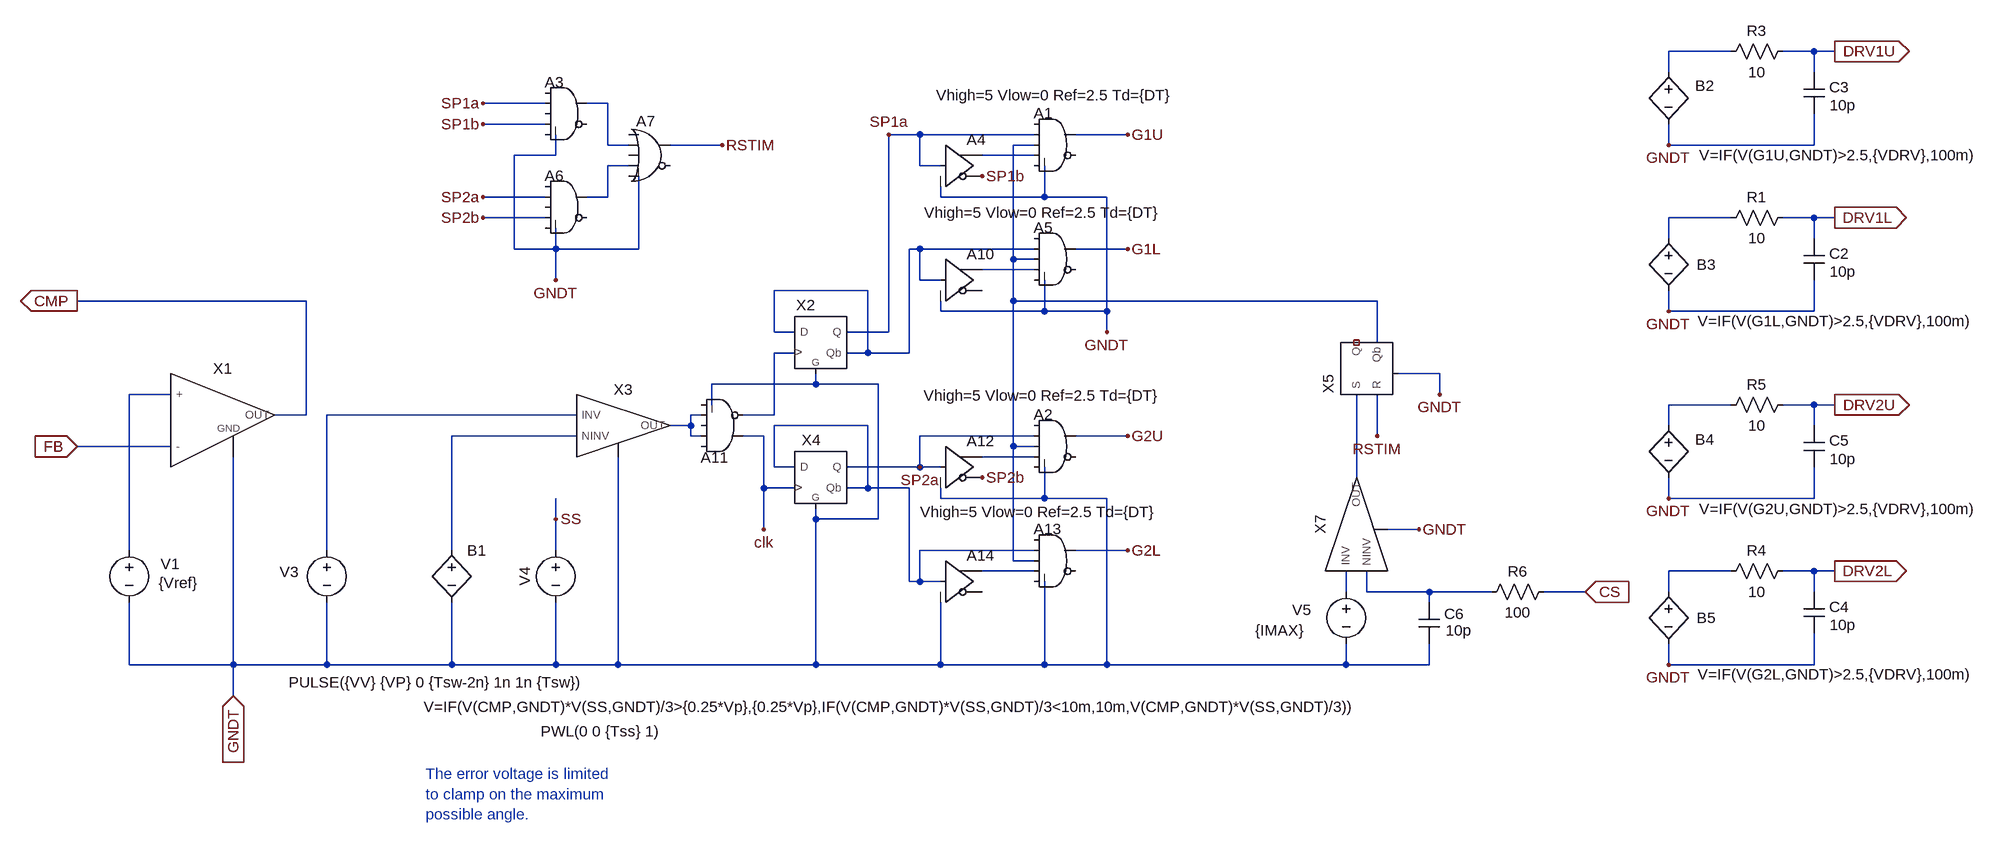
[diagram p0: schematic Generic_DAB_VM_PWM.asc]
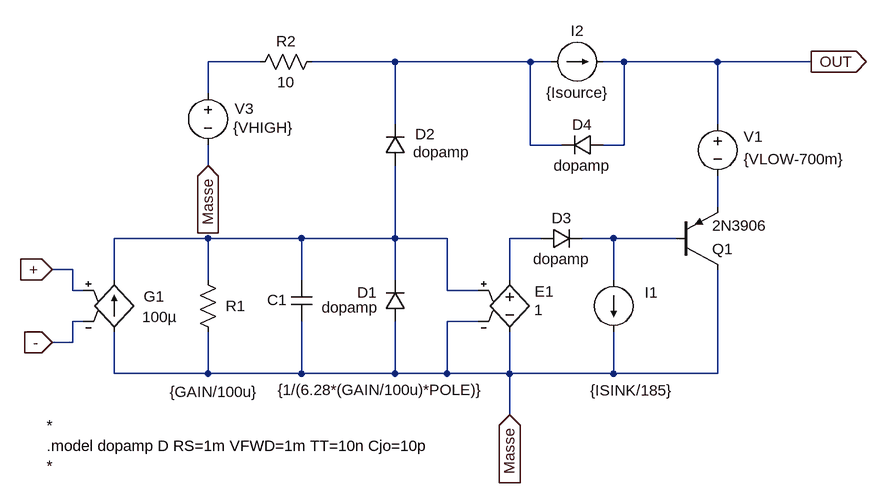
[diagram p1: sub-circuit op_amp_fan_out.asc]
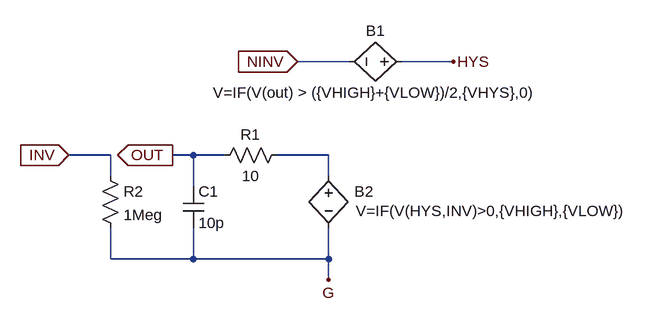
[diagram p2: sub-circuit comptof_g.asc]
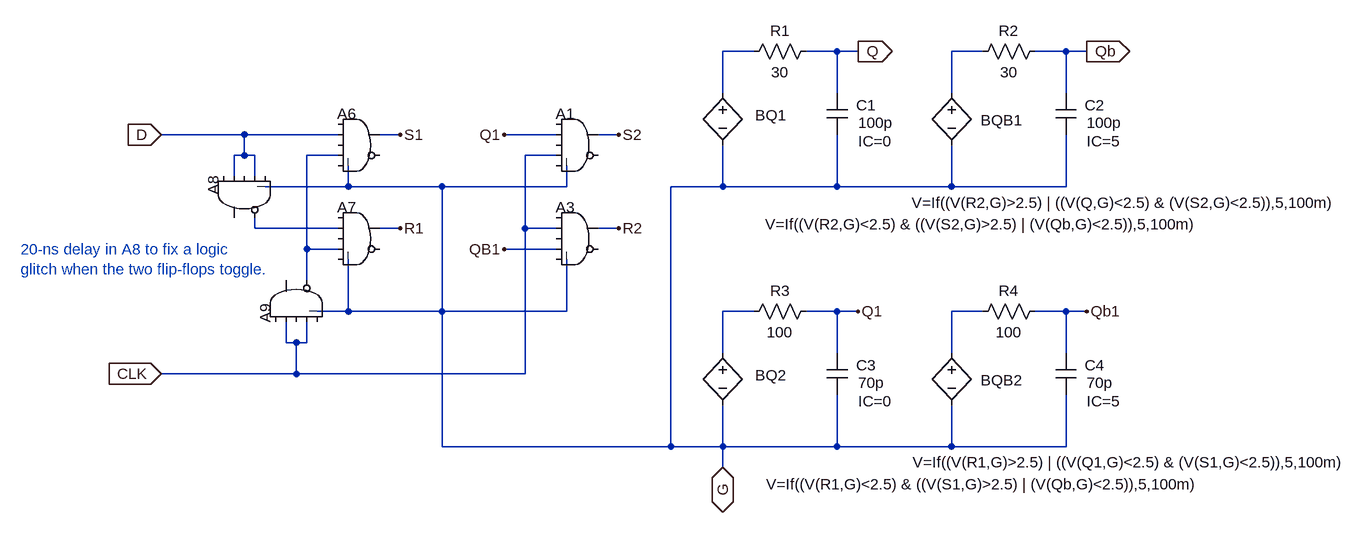
[diagram p3: sub-circuit d_flipflop_g.asc]
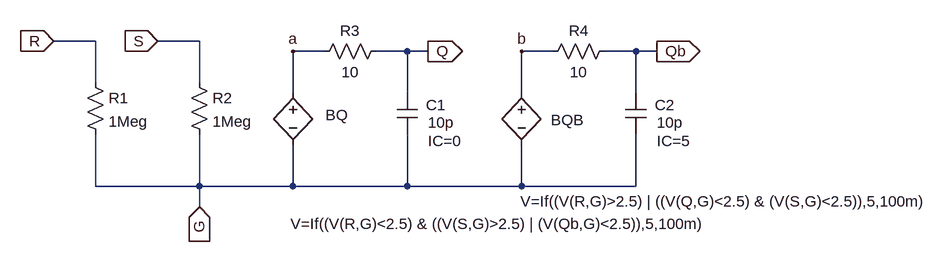
[diagram p4: sub-circuit sr_latch_g.asc]
Generic_DAB_VM_PWM.asc, the LTspice schematic file:
Version 4.1
SHEET 1 1568 1692
WIRE 1072 -832 976 -832
WIRE 1200 -832 1152 -832
WIRE 1232 -832 1200 -832
WIRE 976 -800 976 -832
WIRE 1200 -800 1200 -832
WIRE -752 -752 -848 -752
WIRE -656 -752 -688 -752
WIRE -752 -720 -848 -720
WIRE -176 -704 -224 -704
WIRE 0 -704 -176 -704
WIRE 144 -704 64 -704
WIRE -656 -688 -656 -752
WIRE -624 -688 -656 -688
WIRE -480 -688 -560 -688
WIRE 0 -688 -32 -688
WIRE 976 -688 976 -720
WIRE 1200 -688 1200 -736
WIRE 1200 -688 976 -688
WIRE -736 -672 -736 -704
WIRE -736 -672 -800 -672
WIRE 0 -672 -80 -672
WIRE -624 -656 -656 -656
WIRE -176 -656 -176 -704
WIRE -144 -656 -176 -656
WIRE -752 -608 -848 -608
WIRE -656 -608 -656 -656
WIRE -656 -608 -688 -608
WIRE -144 -608 -144 -624
WIRE 16 -608 16 -656
WIRE 16 -608 -144 -608
WIRE 112 -608 16 -608
WIRE -752 -576 -848 -576
WIRE 1072 -576 976 -576
WIRE 1200 -576 1152 -576
WIRE 1232 -576 1200 -576
WIRE 976 -544 976 -576
WIRE 1200 -544 1200 -576
WIRE -800 -528 -800 -672
WIRE -736 -528 -736 -560
WIRE -736 -528 -800 -528
WIRE -608 -528 -608 -640
WIRE -608 -528 -736 -528
WIRE -176 -528 -192 -528
WIRE 0 -528 -176 -528
WIRE 144 -528 64 -528
WIRE -32 -512 -32 -688
WIRE 0 -512 -32 -512
WIRE 0 -496 -80 -496
WIRE -736 -480 -736 -528
WIRE -176 -480 -176 -528
WIRE -144 -480 -176 -480
WIRE -256 -464 -400 -464
WIRE -1120 -448 -1472 -448
WIRE -32 -448 -32 -512
WIRE 528 -448 -32 -448
WIRE -144 -432 -144 -448
WIRE 16 -432 16 -480
WIRE 16 -432 -144 -432
WIRE 112 -432 112 -608
WIRE 112 -432 16 -432
WIRE 976 -432 976 -464
WIRE 1200 -432 1200 -480
WIRE 1200 -432 976 -432
WIRE -400 -400 -400 -464
WIRE -368 -400 -400 -400
WIRE -224 -400 -224 -704
WIRE -224 -400 -288 -400
WIRE 112 -400 112 -432
WIRE 528 -384 528 -448
WIRE -368 -368 -400 -368
WIRE -256 -368 -256 -464
WIRE -256 -368 -288 -368
WIRE -192 -368 -192 -528
WIRE -192 -368 -256 -368
WIRE 624 -336 560 -336
WIRE -336 -320 -336 -336
WIRE -336 -320 -496 -320
WIRE -240 -320 -336 -320
WIRE -1328 -304 -1392 -304
WIRE 624 -304 624 -336
WIRE -496 -288 -496 -320
WIRE 1072 -288 976 -288
WIRE 1200 -288 1152 -288
WIRE 1232 -288 1200 -288
WIRE -1120 -272 -1120 -448
WIRE -1120 -272 -1168 -272
WIRE -704 -272 -1088 -272
WIRE -512 -272 -528 -272
WIRE -400 -272 -400 -368
WIRE -400 -272 -448 -272
WIRE -528 -256 -528 -272
WIRE -528 -256 -560 -256
WIRE -256 -256 -400 -256
WIRE 976 -256 976 -288
WIRE 1200 -256 1200 -288
WIRE -704 -240 -896 -240
WIRE -528 -240 -528 -256
WIRE -512 -240 -528 -240
WIRE -416 -240 -448 -240
WIRE 0 -240 -176 -240
WIRE 144 -240 64 -240
WIRE 528 -240 528 -304
WIRE -1328 -224 -1472 -224
WIRE -32 -224 -32 -448
WIRE 0 -224 -32 -224
WIRE 0 -208 -80 -208
WIRE -400 -192 -400 -256
WIRE -368 -192 -400 -192
WIRE -176 -192 -176 -240
WIRE -176 -192 -288 -192
WIRE -144 -192 -176 -192
WIRE 496 -176 496 -304
WIRE -416 -160 -416 -240
WIRE -368 -160 -416 -160
WIRE -256 -160 -256 -256
WIRE -256 -160 -288 -160
WIRE -192 -160 -256 -160
WIRE -144 -144 -144 -160
WIRE 16 -144 16 -192
WIRE 16 -144 -144 -144
WIRE 112 -144 16 -144
WIRE 976 -144 976 -176
WIRE 1200 -144 1200 -192
WIRE 1200 -144 976 -144
WIRE -736 -112 -736 -144
WIRE -336 -112 -336 -128
WIRE -240 -112 -240 -320
WIRE -240 -112 -336 -112
WIRE -416 -96 -416 -160
WIRE 592 -96 544 -96
WIRE -1392 -64 -1392 -304
WIRE -1088 -64 -1088 -272
WIRE -896 -64 -896 -240
WIRE -736 -64 -736 -112
WIRE 0 -64 -176 -64
WIRE 144 -64 64 -64
WIRE -32 -48 -32 -224
WIRE 0 -48 -32 -48
WIRE 0 -32 -80 -32
WIRE 1072 -32 976 -32
WIRE 1200 -32 1152 -32
WIRE 1232 -32 1200 -32
WIRE -192 -16 -192 -160
WIRE -176 -16 -176 -64
WIRE -176 -16 -192 -16
WIRE -144 -16 -176 -16
WIRE 480 0 480 -32
WIRE 512 0 512 -32
WIRE 608 0 512 0
WIRE 704 0 608 0
WIRE 848 0 784 0
WIRE 976 0 976 -32
WIRE 1200 0 1200 -32
WIRE 608 16 608 0
WIRE -1392 112 -1392 16
WIRE -1232 112 -1232 -208
WIRE -1232 112 -1392 112
WIRE -1088 112 -1088 16
WIRE -1088 112 -1232 112
WIRE -896 112 -896 16
WIRE -896 112 -1088 112
WIRE -736 112 -736 16
WIRE -736 112 -896 112
WIRE -640 112 -640 -208
WIRE -640 112 -736 112
WIRE -336 112 -336 -112
WIRE -336 112 -640 112
WIRE -144 112 -144 16
WIRE -144 112 -336 112
WIRE 16 112 16 -16
WIRE 16 112 -144 112
WIRE 112 112 112 -144
WIRE 112 112 16 112
WIRE 480 112 480 80
WIRE 480 112 112 112
WIRE 608 112 608 80
WIRE 608 112 480 112
WIRE 976 112 976 80
WIRE 1200 112 1200 64
WIRE 1200 112 976 112
WIRE -1232 160 -1232 112
FLAG -1472 -448 CMP
IOPIN -1472 -448 Out
FLAG -1472 -224 FB
IOPIN -1472 -224 In
FLAG -1232 160 GNDT
IOPIN -1232 160 In
FLAG -736 -112 SS
FLAG 976 -432 GNDT
FLAG 976 -688 GNDT
FLAG 1232 -576 DRV1L
IOPIN 1232 -576 Out
FLAG 1232 -832 DRV1U
IOPIN 1232 -832 Out
FLAG 976 112 GNDT
FLAG 976 -144 GNDT
FLAG 1232 -32 DRV2L
IOPIN 1232 -32 Out
FLAG 1232 -288 DRV2U
IOPIN 1232 -288 Out
FLAG 144 -704 G1U
FLAG 144 -528 G1L
FLAG 144 -240 G2U
FLAG 144 -64 G2L
FLAG 112 -400 GNDT
FLAG -416 -96 clk
FLAG -224 -704 SP1a
FLAG -80 -640 SP1b
FLAG -176 -192 SP2a
FLAG -80 -176 SP2b
FLAG 848 0 CS
IOPIN 848 0 In
FLAG 592 -96 GNDT
FLAG 624 -304 GNDT
FLAG 528 -240 RSTIM
FLAG -848 -752 SP1a
FLAG -848 -720 SP1b
FLAG -848 -608 SP2a
FLAG -848 -576 SP2b
FLAG -480 -688 RSTIM
FLAG -736 -480 GNDT
SYMBOL op_amp_fan_out -1248 -272 R0
SYMATTR InstName X1
SYMATTR SpiceLine gain={gain} pole={pole} Isink={Isink} Isource={Isource} Vlow={VOL} Vhigh={VOH}
SYMBOL voltage -1392 -80 R0
WINDOW 0 48 37 Left 2
WINDOW 3 45 66 Left 2
SYMATTR InstName V1
SYMATTR Value {Vref}
SYMBOL voltage -1088 -80 R0
WINDOW 0 -73 49 Left 2
WINDOW 3 -59 219 Left 2
WINDOW 123 0 0 Left 0
WINDOW 39 0 0 Left 0
SYMATTR InstName V3
SYMATTR Value PULSE({VV} {VP} 0 {Tsw-2n} 1n 1n {Tsw})
SYMBOL bv -896 -80 R0
WINDOW 3 -43 257 Left 2
SYMATTR Value V=IF(V(CMP,GNDT)*V(SS,GNDT)/3>{0.25*Vp},{0.25*Vp},IF(V(CMP,GNDT)*V(SS,GNDT)/3<10m,10m,V(CMP,GNDT)*V(SS,GNDT)/3))
SYMATTR InstName B1
SYMBOL voltage -736 -80 R0
WINDOW 0 -32 56 VBottom 2
WINDOW 3 69 279 Top 2
WINDOW 123 0 0 Left 0
WINDOW 39 0 0 Left 0
SYMATTR InstName V4
SYMATTR Value PWL(0 0 {Tss} 1)
SYMBOL bv 976 -816 R0
WINDOW 0 41 37 Left 2
WINDOW 3 47 144 Left 2
SYMATTR InstName B2
SYMATTR Value V=IF(V(G1U,GNDT)>2.5,{VDRV},100m)
SYMBOL bv 976 -560 R0
WINDOW 0 43 56 Left 2
WINDOW 3 45 143 Left 2
SYMATTR InstName B3
SYMATTR Value V=IF(V(G1L,GNDT)>2.5,{VDRV},100m)
SYMBOL res 1168 -592 R90
WINDOW 0 0 56 VBottom 2
WINDOW 3 32 56 VTop 2
SYMATTR InstName R1
SYMATTR Value 10
SYMBOL cap 1184 -544 R0
WINDOW 0 39 23 Left 2
WINDOW 3 40 51 Left 2
SYMATTR InstName C2
SYMATTR Value 10p
SYMBOL res 1168 -848 R90
WINDOW 0 0 56 VBottom 2
WINDOW 3 32 56 VTop 2
SYMATTR InstName R3
SYMATTR Value 10
SYMBOL cap 1184 -800 R0
WINDOW 0 39 23 Left 2
WINDOW 3 40 51 Left 2
SYMATTR InstName C3
SYMATTR Value 10p
SYMBOL Digital\\and 32 -752 R0
WINDOW 0 -33 15 Left 2
SYMATTR InstName A1
SYMATTR SpiceLine Vhigh=5 Vlow=0 Ref=2.5
SYMBOL Digital\\buf -144 -720 R0
WINDOW 39 -7 -45 Left 2
SYMATTR SpiceLine Vhigh=5 Vlow=0 Ref=2.5 Td={DT}
SYMATTR InstName A4
SYMBOL Digital\\and 32 -576 R0
WINDOW 0 -33 15 Left 2
SYMATTR InstName A5
SYMATTR SpiceLine Vhigh=5 Vlow=0 Ref=2.5
SYMBOL Digital\\buf -144 -544 R0
WINDOW 39 -25 -40 Left 2
SYMATTR SpiceLine Vhigh=5 Vlow=0 Ref=2.5 Td={DT}
SYMATTR InstName A10
SYMBOL Digital\\and -480 -192 M180
WINDOW 0 -33 15 Left 2
SYMATTR InstName A11
SYMATTR SpiceLine Vhigh=5 Vlow=0 Ref=2.5
SYMBOL Digital\\and 32 -288 R0
WINDOW 0 -33 15 Left 2
SYMATTR InstName A2
SYMATTR SpiceLine Vhigh=5 Vlow=0 Ref=2.5
SYMBOL Digital\\buf -144 -256 R0
WINDOW 39 -26 -46 Left 2
SYMATTR SpiceLine Vhigh=5 Vlow=0 Ref=2.5 Td={DT}
SYMATTR InstName A12
SYMBOL Digital\\and 32 -112 R0
WINDOW 0 -33 15 Left 2
SYMATTR InstName A13
SYMATTR SpiceLine Vhigh=5 Vlow=0 Ref=2.5
SYMBOL Digital\\buf -144 -80 R0
WINDOW 39 -31 -43 Left 2
SYMATTR SpiceLine Vhigh=5 Vlow=0 Ref=2.5 Td={DT}
SYMATTR InstName A14
SYMBOL bv 976 -272 R0
WINDOW 0 41 37 Left 2
WINDOW 3 47 144 Left 2
SYMATTR InstName B4
SYMATTR Value V=IF(V(G2U,GNDT)>2.5,{VDRV},100m)
SYMBOL bv 976 -16 R0
WINDOW 0 43 56 Left 2
WINDOW 3 45 143 Left 2
SYMATTR InstName B5
SYMATTR Value V=IF(V(G2L,GNDT)>2.5,{VDRV},100m)
SYMBOL res 1168 -48 R90
WINDOW 0 0 56 VBottom 2
WINDOW 3 32 56 VTop 2
SYMATTR InstName R4
SYMATTR Value 10
SYMBOL cap 1184 0 R0
WINDOW 0 39 23 Left 2
WINDOW 3 40 51 Left 2
SYMATTR InstName C4
SYMATTR Value 10p
SYMBOL res 1168 -304 R90
WINDOW 0 0 56 VBottom 2
WINDOW 3 32 56 VTop 2
SYMATTR InstName R5
SYMATTR Value 10
SYMBOL cap 1184 -256 R0
WINDOW 0 39 23 Left 2
WINDOW 3 40 51 Left 2
SYMATTR InstName C5
SYMATTR Value 10p
SYMBOL voltage 480 -16 R0
WINDOW 0 -83 44 Left 2
WINDOW 3 -140 75 Left 2
SYMATTR InstName V5
SYMATTR Value {IMAX}
SYMBOL res 800 -16 R90
WINDOW 0 0 56 VBottom 2
WINDOW 3 32 56 VTop 2
SYMATTR InstName R6
SYMATTR Value 100
SYMBOL cap 592 16 R0
WINDOW 0 39 18 Left 2
WINDOW 3 41 43 Left 2
SYMATTR InstName C6
SYMATTR Value 10p
SYMBOL Digital\\and -720 -800 R0
WINDOW 0 -33 15 Left 2
SYMATTR InstName A3
SYMATTR SpiceLine Vhigh=5 Vlow=0 Ref=2.5
SYMBOL Digital\\and -720 -656 R0
WINDOW 0 -33 15 Left 2
SYMATTR InstName A6
SYMATTR SpiceLine Vhigh=5 Vlow=0 Ref=2.5
SYMBOL Digital\\or -592 -736 R0
WINDOW 0 -20 11 Left 2
SYMATTR InstName A7
SYMATTR SpiceLine Vhigh=5 Vlow=0 Ref=2.5
SYMBOL TOF\\Subcircuits\\COMPTOF_G -640 -256 R0
SYMATTR InstName X3
SYMATTR SpiceLine VHIGH=5 VLOW=100m VHYS=10m
SYMBOL TOF\\Subcircuits\\D_FlipFlop_G -336 -384 R0
WINDOW 0 -15 -42 Bottom 2
SYMATTR InstName X2
SYMBOL TOF\\Subcircuits\\D_FlipFlop_G -336 -176 R0
WINDOW 0 -7 -42 Bottom 2
SYMATTR InstName X4
SYMBOL TOF\\Subcircuits\\SR_latch_G 512 -336 R270
WINDOW 0 -16 -44 Bottom 2
SYMATTR InstName X5
SYMBOL TOF\\Subcircuits\\COMPTOF_G 496 -96 R270
SYMATTR InstName X7
SYMATTR SpiceLine VHIGH=5 VLOW=100m VHYS=50m
TEXT -936 280 Left 2 ;The error voltage is limited\nto clamp on the maximum \npossible angle.

op_amp_fan_out.asc, the sub-circuit schematic file:
Version 4.1
SHEET 1 1504 680
WIRE 96 -224 16 -224
WIRE 304 -224 176 -224
WIRE 512 -224 304 -224
WIRE 544 -224 512 -224
WIRE 656 -224 624 -224
WIRE 800 -224 656 -224
WIRE 944 -224 800 -224
WIRE 16 -176 16 -224
WIRE 304 -128 304 -224
WIRE 800 -128 800 -224
WIRE 512 -96 512 -224
WIRE 560 -96 512 -96
WIRE 656 -96 656 -224
WIRE 656 -96 624 -96
WIRE 16 -64 16 -96
WIRE 800 0 800 -48
WIRE 16 48 -128 48
WIRE 160 48 16 48
WIRE 304 48 304 -64
WIRE 304 48 160 48
WIRE 384 48 304 48
WIRE 528 48 480 48
WIRE 640 48 592 48
WIRE 736 48 640 48
WIRE -192 96 -224 96
WIRE -128 112 -128 48
WIRE 16 112 16 48
WIRE 160 112 160 48
WIRE 304 112 304 48
WIRE 480 112 480 48
WIRE 640 112 640 48
WIRE -192 128 -192 96
WIRE -176 128 -192 128
WIRE 384 128 384 48
WIRE 432 128 384 128
WIRE -176 176 -192 176
WIRE 432 176 384 176
WIRE -192 208 -192 176
WIRE -192 208 -224 208
WIRE -128 256 -128 192
WIRE 16 256 16 192
WIRE 16 256 -128 256
WIRE 160 256 160 176
WIRE 160 256 16 256
WIRE 304 256 304 176
WIRE 304 256 160 256
WIRE 384 256 384 176
WIRE 384 256 304 256
WIRE 480 256 480 192
WIRE 480 256 384 256
WIRE 640 256 640 192
WIRE 640 256 480 256
WIRE 800 256 800 96
WIRE 800 256 640 256
WIRE 480 320 480 256
FLAG -224 96 +
IOPIN -224 96 In
FLAG -224 208 -
IOPIN -224 208 In
FLAG 944 -224 OUT
IOPIN 944 -224 Out
FLAG 480 320 Masse
IOPIN 480 320 In
FLAG 16 -64 Masse
IOPIN 16 -64 In
DATAFLAG 800 -16 ""
SYMBOL g -128 96 R0
WINDOW 0 45 41 Left 2
WINDOW 3 43 73 Left 2
SYMATTR InstName G1
SYMATTR Value 100µ
SYMBOL res 0 96 R0
WINDOW 0 43 56 Left 2
WINDOW 3 -43 188 Left 2
SYMATTR InstName R1
SYMATTR Value {GAIN/100u}
SYMBOL cap 144 112 R0
WINDOW 0 -37 31 Left 2
WINDOW 3 -21 169 Left 2
SYMATTR InstName C1
SYMATTR Value {1/(6.28*(GAIN/100u)*POLE)}
SYMBOL diode 320 176 R180
WINDOW 0 44 45 Left 2
WINDOW 3 41 22 Left 2
SYMATTR InstName D1
SYMATTR Value dopamp
SYMBOL e 480 96 R0
WINDOW 0 39 34 Left 2
WINDOW 3 38 62 Left 2
SYMATTR InstName E1
SYMATTR Value 1
SYMBOL diode 528 64 R270
WINDOW 0 32 32 VTop 2
WINDOW 3 0 32 VBottom 2
SYMATTR InstName D3
SYMATTR Value dopamp
SYMBOL current 640 112 R0
WINDOW 0 48 19 Left 2
WINDOW 3 -36 170 Left 2
SYMATTR InstName I1
SYMATTR Value {ISINK/185}
SYMBOL pnp 736 96 M180
SYMATTR InstName Q1
SYMATTR Value 2N3906
SYMBOL voltage 800 -144 R0
WINDOW 0 40 35 Left 2
WINDOW 3 40 70 Left 2
SYMATTR InstName V1
SYMATTR Value {VLOW-700m}
SYMBOL current 544 -224 R270
WINDOW 0 32 40 VTop 2
WINDOW 3 -32 40 VBottom 2
SYMATTR InstName I2
SYMATTR Value {Isource}
SYMBOL diode 624 -80 M270
WINDOW 0 32 32 VTop 2
WINDOW 3 0 32 VBottom 2
SYMATTR InstName D4
SYMATTR Value dopamp
SYMBOL voltage 16 -192 R0
WINDOW 0 41 40 Left 2
WINDOW 3 39 69 Left 2
SYMATTR InstName V3
SYMATTR Value {VHIGH}
SYMBOL diode 288 -64 M180
WINDOW 0 47 49 Left 2
WINDOW 3 44 21 Left 2
SYMATTR InstName D2
SYMATTR Value dopamp
SYMBOL res 192 -240 R90
WINDOW 0 0 56 VBottom 2
WINDOW 3 32 56 VTop 2
SYMATTR InstName R2
SYMATTR Value 10
TEXT -232 336 Left 2 !*\n.model dopamp D RS=1m VFWD=1m TT=10n Cjo=10p\n*

comptof_g.asc, the sub-circuit schematic file:
Version 4.1
SHEET 1 880 680
WIRE 64 192 -16 192
WIRE 224 192 144 192
WIRE -304 336 -368 336
WIRE -176 336 -208 336
WIRE -128 336 -176 336
WIRE 32 336 -48 336
WIRE -304 368 -304 336
WIRE 32 368 32 336
WIRE -176 384 -176 336
WIRE -304 496 -304 448
WIRE -176 496 -176 448
WIRE -176 496 -304 496
WIRE 32 496 32 448
WIRE 32 496 -176 496
WIRE 32 528 32 496
FLAG -16 192 NINV
IOPIN -16 192 In
FLAG 224 192 HYS
FLAG -208 336 OUT
IOPIN -208 336 Out
FLAG -368 336 INV
IOPIN -368 336 In
FLAG 32 528 G
SYMBOL bv 160 192 R90
WINDOW 0 -32 56 VBottom 2
WINDOW 3 32 56 VTop 2
SYMATTR InstName B1
SYMATTR Value V=IF(V(out) > ({VHIGH}+{VLOW})/2,{VHYS},0)
SYMBOL bv 32 352 R0
WINDOW 0 40 40 Left 2
WINDOW 3 42 70 Left 2
SYMATTR InstName B2
SYMATTR Value V=IF(V(HYS,INV)>0,{VHIGH},{VLOW})
SYMBOL res -32 320 R90
WINDOW 0 0 56 VBottom 2
WINDOW 3 32 56 VTop 2
SYMATTR InstName R1
SYMATTR Value 10
SYMBOL cap -192 384 R0
SYMATTR InstName C1
SYMATTR Value 10p
SYMBOL res -320 352 R0
SYMATTR InstName R2
SYMATTR Value 1Meg

d_flipflop_g.asc, the sub-circuit schematic file:
Version 4.1
SHEET 1 1820 1368
WIRE 768 448 720 448
WIRE 896 448 848 448
WIRE 928 448 896 448
WIRE 1120 448 1072 448
WIRE 1248 448 1200 448
WIRE 1280 448 1248 448
WIRE 720 512 720 448
WIRE 896 512 896 448
WIRE 1072 512 1072 448
WIRE 1248 512 1248 448
WIRE -16 576 -144 576
WIRE 128 576 -16 576
WIRE 224 576 192 576
WIRE 464 576 384 576
WIRE 560 576 528 576
WIRE -16 608 -16 576
WIRE -16 608 -32 608
WIRE 0 608 -16 608
WIRE 128 608 80 608
WIRE 464 608 416 608
WIRE -32 640 -32 608
WIRE 0 640 0 608
WIRE 144 656 144 624
WIRE 144 656 16 656
WIRE 288 656 144 656
WIRE 480 656 480 624
WIRE 480 656 288 656
WIRE 720 656 720 592
WIRE 720 656 640 656
WIRE 896 656 896 576
WIRE 896 656 720 656
WIRE 1072 656 1072 592
WIRE 1072 656 896 656
WIRE 1248 656 1248 576
WIRE 1248 656 1072 656
WIRE 0 720 0 704
WIRE 128 720 0 720
WIRE 224 720 192 720
WIRE 416 720 416 608
WIRE 464 720 416 720
WIRE 560 720 528 720
WIRE 80 752 80 608
WIRE 128 752 80 752
WIRE 464 752 384 752
WIRE 80 800 80 752
WIRE 144 848 144 768
WIRE 144 848 96 848
WIRE 288 848 288 656
WIRE 288 848 144 848
WIRE 480 848 480 768
WIRE 480 848 288 848
WIRE 768 848 720 848
WIRE 896 848 848 848
WIRE 928 848 896 848
WIRE 1120 848 1072 848
WIRE 1248 848 1200 848
WIRE 1280 848 1248 848
WIRE 48 896 48 864
WIRE 64 896 48 896
WIRE 80 896 80 864
WIRE 80 896 64 896
WIRE 720 912 720 848
WIRE 896 912 896 848
WIRE 1072 912 1072 848
WIRE 1248 912 1248 848
WIRE 64 944 64 896
WIRE 64 944 -144 944
WIRE 416 944 416 720
WIRE 416 944 64 944
WIRE 288 1056 288 848
WIRE 640 1056 640 656
WIRE 640 1056 288 1056
WIRE 720 1056 720 992
WIRE 720 1056 640 1056
WIRE 896 1056 896 976
WIRE 896 1056 720 1056
WIRE 1072 1056 1072 992
WIRE 1072 1056 896 1056
WIRE 1248 1056 1248 976
WIRE 1248 1056 1072 1056
WIRE 720 1088 720 1056
FLAG -144 576 D
IOPIN -144 576 In
FLAG -144 944 CLK
IOPIN -144 944 In
FLAG 560 576 S2
FLAG 560 720 R2
FLAG 928 448 Q
IOPIN 928 448 Out
FLAG 1280 448 Qb
IOPIN 1280 448 Out
FLAG 224 576 S1
FLAG 224 720 R1
FLAG 384 576 Q1
FLAG 384 752 QB1
FLAG 928 848 Q1
FLAG 1280 848 Qb1
FLAG 720 1088 G
IOPIN 720 1088 BiDir
SYMBOL Digital\\and 496 528 R0
WINDOW 0 -33 16 Left 2
SYMATTR InstName A1
SYMATTR SpiceLine Vhigh=5 Vlow=100m Ref=2.5
SYMBOL Digital\\and 496 672 R0
WINDOW 0 -33 16 Left 2
SYMATTR InstName A3
SYMATTR SpiceLine Vhigh=5 Vlow=100m Ref=2.5
SYMBOL Digital\\and 160 528 R0
WINDOW 0 -33 16 Left 2
SYMATTR InstName A6
SYMATTR SpiceLine Vhigh=5 Vlow=100m Ref=2.5
SYMBOL Digital\\and 160 672 R0
WINDOW 0 -33 16 Left 2
SYMATTR InstName A7
SYMATTR SpiceLine Vhigh=5 Vlow=100m Ref=2.5
SYMBOL Digital\\and -80 672 M90
WINDOW 0 -33 16 Left 2
SYMATTR InstName A8
SYMATTR SpiceLine Vhigh=5 Vlow=100m Ref=2.5 Td=20n
SYMBOL Digital\\and 0 832 R270
WINDOW 0 -33 16 Left 2
SYMATTR InstName A9
SYMATTR SpiceLine Vhigh=5 Vlow=100m Ref=2.5
SYMBOL bv 720 496 R0
WINDOW 0 50 50 Left 2
WINDOW 3 65 218 Left 2
SYMATTR InstName BQ1
SYMATTR Value V=If((V(R2,G)<2.5) & ((V(S2,G)>2.5) | (V(Qb,G)<2.5)),5,100m)
SYMBOL res 864 432 R90
WINDOW 0 0 56 VBottom 2
WINDOW 3 32 56 VTop 2
SYMATTR InstName R1
SYMATTR Value 30
SYMBOL cap 880 512 R0
WINDOW 0 45 19 Left 2
WINDOW 3 48 46 Left 2
WINDOW 123 48 74 Left 2
SYMATTR InstName C1
SYMATTR Value 100p
SYMATTR Value2 IC=0
SYMBOL bv 1072 496 R0
WINDOW 0 45 58 Left 2
WINDOW 3 -61 185 Left 2
SYMATTR InstName BQB1
SYMATTR Value V=If((V(R2,G)>2.5) | ((V(Q,G)<2.5) & (V(S2,G)<2.5)),5,100m)
SYMBOL res 1216 432 R90
WINDOW 0 0 56 VBottom 2
WINDOW 3 32 56 VTop 2
SYMATTR InstName R2
SYMATTR Value 30
SYMBOL cap 1232 512 R0
WINDOW 0 45 19 Left 2
WINDOW 3 48 46 Left 2
WINDOW 123 48 74 Left 2
SYMATTR InstName C2
SYMATTR Value 100p
SYMATTR Value2 IC=5
SYMBOL bv 720 896 R0
WINDOW 0 50 50 Left 2
WINDOW 3 67 218 Left 2
SYMATTR InstName BQ2
SYMATTR Value V=If((V(R1,G)<2.5) & ((V(S1,G)>2.5) | (V(Qb,G)<2.5)),5,100m)
SYMBOL res 864 832 R90
WINDOW 0 0 56 VBottom 2
WINDOW 3 32 56 VTop 2
SYMATTR InstName R3
SYMATTR Value 100
SYMBOL cap 880 912 R0
WINDOW 0 45 19 Left 2
WINDOW 3 48 46 Left 2
WINDOW 123 48 74 Left 2
SYMATTR InstName C3
SYMATTR Value 70p
SYMATTR Value2 IC=0
SYMBOL bv 1072 896 R0
WINDOW 0 45 58 Left 2
WINDOW 3 -60 184 Left 2
SYMATTR InstName BQB2
SYMATTR Value V=If((V(R1,G)>2.5) | ((V(Q1,G)<2.5) & (V(S1,G)<2.5)),5,100m)
SYMBOL res 1216 832 R90
WINDOW 0 0 56 VBottom 2
WINDOW 3 32 56 VTop 2
SYMATTR InstName R4
SYMATTR Value 100
SYMBOL cap 1232 912 R0
WINDOW 0 45 19 Left 2
WINDOW 3 48 46 Left 2
WINDOW 123 48 74 Left 2
SYMATTR InstName C4
SYMATTR Value 70p
SYMATTR Value2 IC=5
TEXT -360 752 Left 2 ;20-ns delay in A8 to fix a logic \nglitch when the two flip-flops toggle.

sr_latch_g.asc, the sub-circuit schematic file:
Version 4.1
SHEET 1 1168 680
WIRE -192 48 -256 48
WIRE -32 48 -96 48
WIRE 160 64 112 64
WIRE 288 64 240 64
WIRE 320 64 288 64
WIRE 512 64 464 64
WIRE 640 64 592 64
WIRE 672 64 640 64
WIRE -192 112 -192 48
WIRE -32 112 -32 48
WIRE 112 128 112 64
WIRE 288 128 288 64
WIRE 464 128 464 64
WIRE 640 128 640 64
WIRE -192 272 -192 192
WIRE -32 272 -32 192
WIRE -32 272 -192 272
WIRE 112 272 112 208
WIRE 112 272 -32 272
WIRE 288 272 288 192
WIRE 288 272 112 272
WIRE 464 272 464 208
WIRE 464 272 288 272
WIRE 640 272 640 192
WIRE 640 272 464 272
WIRE -32 304 -32 272
FLAG -256 48 R
IOPIN -256 48 In
FLAG -96 48 S
IOPIN -96 48 In
FLAG 320 64 Q
IOPIN 320 64 Out
FLAG 672 64 Qb
IOPIN 672 64 Out
FLAG 112 64 a
FLAG 464 64 b
FLAG -32 304 G
IOPIN -32 304 In
SYMBOL bv 112 112 R0
WINDOW 0 50 50 Left 2
WINDOW 3 -4 218 Left 2
SYMATTR InstName BQ
SYMATTR Value V=If((V(R,G)<2.5) & ((V(S,G)>2.5) | (V(Qb,G)<2.5)),5,100m)
SYMBOL res -208 96 R0
SYMATTR InstName R1
SYMATTR Value 1Meg
SYMBOL res -48 96 R0
SYMATTR InstName R2
SYMATTR Value 1Meg
SYMBOL res 256 48 R90
WINDOW 0 0 56 VBottom 2
WINDOW 3 32 56 VTop 2
SYMATTR InstName R3
SYMATTR Value 10
SYMBOL cap 272 128 R0
WINDOW 0 45 19 Left 2
WINDOW 3 48 46 Left 2
WINDOW 123 48 74 Left 2
SYMATTR InstName C1
SYMATTR Value 10p
SYMATTR Value2 IC=0
SYMBOL bv 464 112 R0
WINDOW 0 45 58 Left 2
WINDOW 3 -2 183 Left 2
SYMATTR InstName BQB
SYMATTR Value V=If((V(R,G)>2.5) | ((V(Q,G)<2.5) & (V(S,G)<2.5)),5,100m)
SYMBOL res 608 48 R90
WINDOW 0 0 56 VBottom 2
WINDOW 3 32 56 VTop 2
SYMATTR InstName R4
SYMATTR Value 10
SYMBOL cap 624 128 R0
WINDOW 0 45 19 Left 2
WINDOW 3 48 46 Left 2
WINDOW 123 48 74 Left 2
SYMATTR InstName C2
SYMATTR Value 10p
SYMATTR Value2 IC=5

The netlist it stands for:
* Generic_DAB_VM_PWM.asc
X§X1 N010 FB GNDT CMP op_amp_fan_out params: gain={gain} pole={pole} Isink={Isink} Isource={Isource} Vlow={VOL} Vhigh={VOH}
V1 N010 GNDT {Vref}
V3 N012 GNDT PULSE({VV} {VP} 0 {Tsw-2n} 1n 1n {Tsw})
B1 N015 GNDT V=IF(V(CMP,GNDT)*V(SS,GNDT)/3>{0.25*Vp},{0.25*Vp},IF(V(CMP,GNDT)*V(SS,GNDT)/3<10m,10m,V(CMP,GNDT)*V(SS,GNDT)/3))
V4 SS GNDT PWL(0 0 {Tss} 1)
B2 N001 GNDT V=IF(V(G1U,GNDT)>2.5,{VDRV},100m)
B3 N006 GNDT V=IF(V(G1L,GNDT)>2.5,{VDRV},100m)
R1 DRV1L N006 10
C2 DRV1L GNDT 10p
R3 DRV1U N001 10
C3 DRV1U GNDT 10p
A1 GNDT SP1a N003 N004 GNDT GNDT G1U GNDT AND Vhigh=5 Vlow=0 Ref=2.5
A4 SP1a GNDT GNDT GNDT GNDT SP1b N004 GNDT BUF Vhigh=5 Vlow=0 Ref=2.5 Td={DT}
A5 GNDT N007 N003 N008 GNDT GNDT G1L GNDT AND Vhigh=5 Vlow=0 Ref=2.5
A10 N007 GNDT GNDT GNDT GNDT GNDT N008 GNDT BUF Vhigh=5 Vlow=0 Ref=2.5 Td={DT}
A11 GNDT N013 GNDT N013 GNDT N009 clk GNDT AND Vhigh=5 Vlow=0 Ref=2.5
A2 GNDT SP2a N003 N016 GNDT GNDT G2U GNDT AND Vhigh=5 Vlow=0 Ref=2.5
A12 SP2a GNDT GNDT GNDT GNDT SP2b N016 GNDT BUF Vhigh=5 Vlow=0 Ref=2.5 Td={DT}
A13 GNDT N014 N003 N018 GNDT GNDT G2L GNDT AND Vhigh=5 Vlow=0 Ref=2.5
A14 N014 GNDT GNDT GNDT GNDT GNDT N018 GNDT BUF Vhigh=5 Vlow=0 Ref=2.5 Td={DT}
B4 N011 GNDT V=IF(V(G2U,GNDT)>2.5,{VDRV},100m)
B5 N019 GNDT V=IF(V(G2L,GNDT)>2.5,{VDRV},100m)
R4 DRV2L N019 10
C4 DRV2L GNDT 10p
R5 DRV2U N011 10
C5 DRV2U GNDT 10p
V5 N020 GNDT {IMAX}
R6 CS N021 100
C6 N021 GNDT 10p
A3 GNDT SP1a GNDT SP1b GNDT GNDT N002 GNDT AND Vhigh=5 Vlow=0 Ref=2.5
A6 GNDT SP2a GNDT SP2b GNDT GNDT N005 GNDT AND Vhigh=5 Vlow=0 Ref=2.5
A7 GNDT N002 GNDT N005 GNDT GNDT RSTIM GNDT OR Vhigh=5 Vlow=0 Ref=2.5
X§X3 N012 N015 N013 GNDT comptof_g params: VHIGH=5 VLOW=100m VHYS=10m
X§X2 N007 N009 SP1a N007 GNDT d_flipflop_g
X§X4 N014 clk SP2a N014 GNDT d_flipflop_g
X§X5 RSTIM N017 NC_01 N003 GNDT sr_latch_g
X§X7 N020 N021 N017 GNDT comptof_g params: VHIGH=5 VLOW=100m VHYS=50m

* block symbol definitions
.subckt op_amp_fan_out + - Masse OUT
G1 Masse N004 + - 100µ
R1 N004 Masse {GAIN/100u}
C1 N004 Masse {1/(6.28*(GAIN/100u)*POLE)}
D1 Masse N004 dopamp
E1 N005 Masse N004 Masse 1
D3 N005 N006 dopamp
I1 N006 Masse {ISINK/185}
Q1 Masse N006 N003 0 2N3906
V1 OUT N003 {VLOW-700m}
I2 N002 OUT {Isource}
D4 OUT N002 dopamp
V3 N001 Masse {VHIGH}
D2 N004 N002 dopamp
R2 N002 N001 10
*
.model dopamp D RS=1m VFWD=1m TT=10n Cjo=10p
*
.ends op_amp_fan_out

.subckt comptof_g INV NINV OUT G
B1 HYS NINV V=IF(V(out) > ({VHIGH}+{VLOW})/2,{VHYS},0)
B2 N001 G V=IF(V(HYS,INV)>0,{VHIGH},{VLOW})
R1 N001 OUT 10
C1 OUT G 10p
R2 INV G 1Meg
.ends comptof_g

.subckt d_flipflop_g D CLK Q Qb G
A1 G Q1 G CLK G G S2 G AND Vhigh=5 Vlow=100m Ref=2.5
A3 G CLK G QB1 G G R2 G AND Vhigh=5 Vlow=100m Ref=2.5
A6 G D G N003 G G S1 G AND Vhigh=5 Vlow=100m Ref=2.5
A7 G N004 G N003 G G R1 G AND Vhigh=5 Vlow=100m Ref=2.5
A8 G D G D G N004 G G AND Vhigh=5 Vlow=100m Ref=2.5 Td=20n
A9 G CLK G CLK G N003 G G AND Vhigh=5 Vlow=100m Ref=2.5
BQ1 N001 G V=If((V(R2,G)<2.5) & ((V(S2,G)>2.5) | (V(Qb,G)<2.5)),5,100m)
R1 Q N001 30
C1 Q G 100p IC=0
BQB1 N002 G V=If((V(R2,G)>2.5) | ((V(Q,G)<2.5) & (V(S2,G)<2.5)),5,100m)
R2 Qb N002 30
C2 Qb G 100p IC=5
BQ2 N005 G V=If((V(R1,G)<2.5) & ((V(S1,G)>2.5) | (V(Qb,G)<2.5)),5,100m)
R3 Q1 N005 100
C3 Q1 G 70p IC=0
BQB2 N006 G V=If((V(R1,G)>2.5) | ((V(Q1,G)<2.5) & (V(S1,G)<2.5)),5,100m)
R4 QB1 N006 100
C4 QB1 G 70p IC=5
* 20-ns delay in A8 to fix a logic
* glitch when the two flip-flops toggle.
.ends d_flipflop_g

.subckt sr_latch_g R S Q Qb G
BQ a G V=If((V(R,G)<2.5) & ((V(S,G)>2.5) | (V(Qb,G)<2.5)),5,100m)
R1 R G 1Meg
R2 S G 1Meg
R3 Q a 10
C1 Q G 10p IC=0
BQB b G V=If((V(R,G)>2.5) | ((V(Q,G)<2.5) & (V(S,G)<2.5)),5,100m)
R4 Qb b 10
C2 Qb G 10p IC=5
.ends sr_latch_g

.model D D
.lib standard.dio
.model NPN NPN
.model PNP PNP
.lib standard.bjt
* The error voltage is limited
* to clamp on the maximum
* possible angle.
.backanno
.end